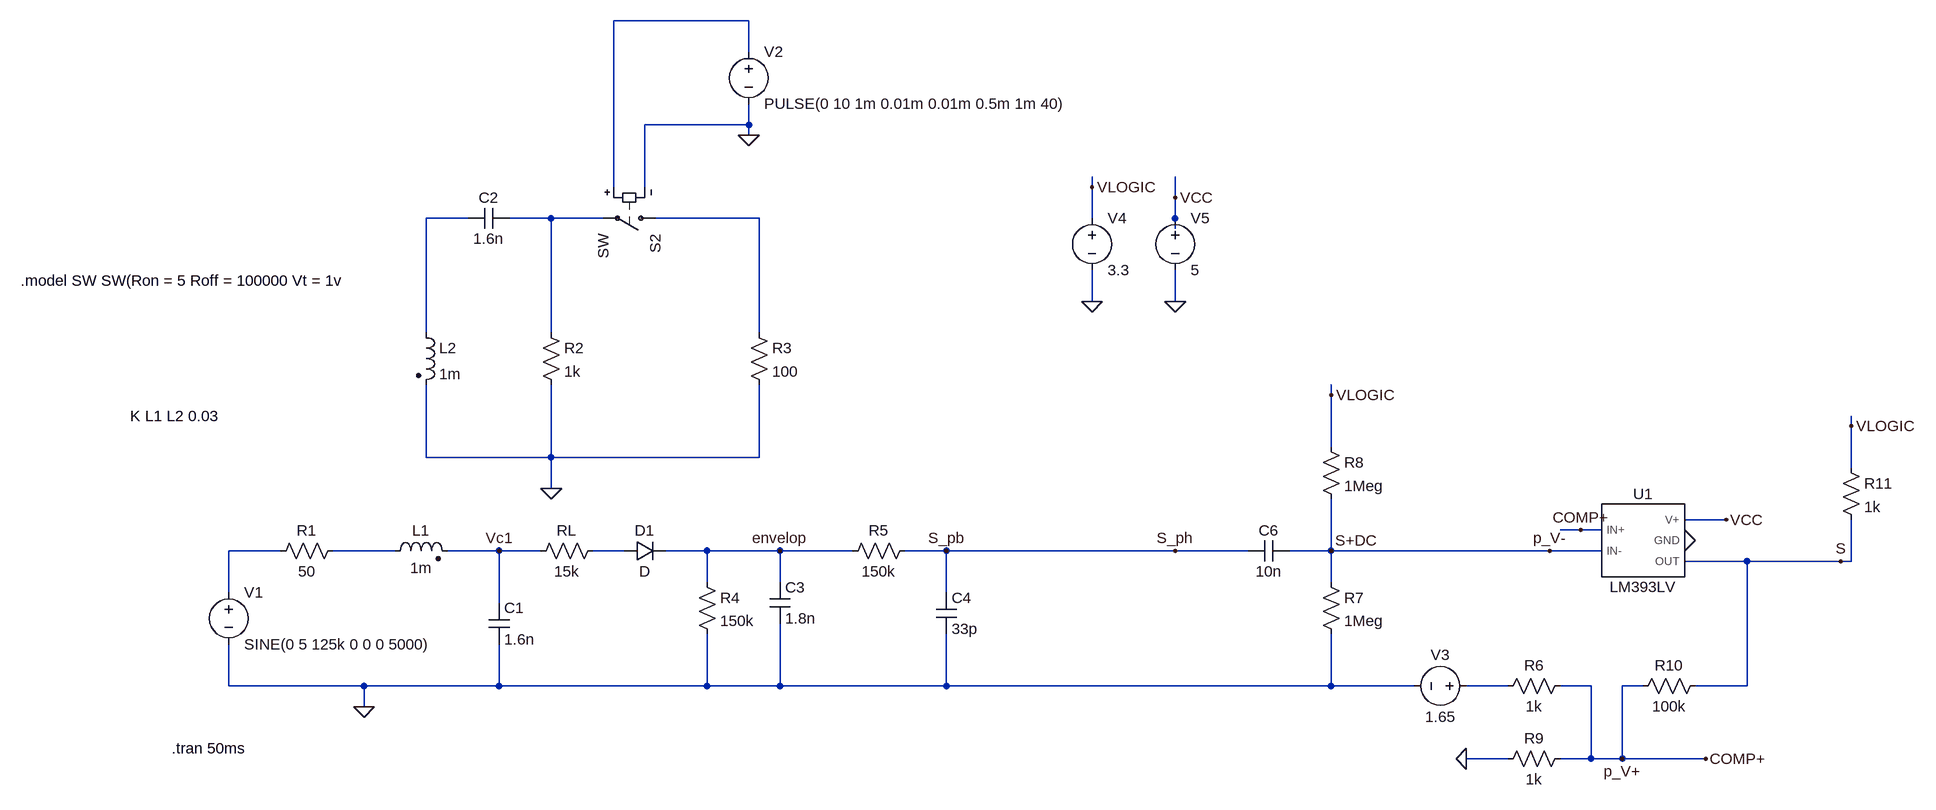
[diagram p0: schematic PJ_elec2.asc]
PJ_elec2.asc, the LTspice schematic file:
Version 4
SHEET 1 2644 680
WIRE 880 -784 672 -784
WIRE 880 -736 880 -784
WIRE 880 -624 880 -656
WIRE 880 -624 720 -624
WIRE 880 -608 880 -624
WIRE 672 -528 672 -784
WIRE 720 -528 720 -624
WIRE 1408 -528 1408 -544
WIRE 1536 -512 1536 -544
WIRE 448 -480 384 -480
WIRE 576 -480 512 -480
WIRE 656 -480 576 -480
WIRE 896 -480 736 -480
WIRE 1408 -480 1408 -528
WIRE 1536 -480 1536 -512
WIRE 1536 -464 1536 -480
WIRE 1408 -352 1408 -400
WIRE 1536 -352 1536 -400
WIRE 384 -304 384 -480
WIRE 576 -304 576 -480
WIRE 896 -304 896 -480
WIRE 1776 -208 1776 -224
WIRE 2576 -160 2576 -176
WIRE 1776 -128 1776 -208
WIRE 384 -112 384 -224
WIRE 576 -112 576 -224
WIRE 576 -112 384 -112
WIRE 896 -112 896 -224
WIRE 896 -112 576 -112
WIRE 2576 -96 2576 -160
WIRE 576 -64 576 -112
WIRE 2384 -16 2320 -16
WIRE 2160 0 2128 0
WIRE 2192 0 2160 0
WIRE 160 32 80 32
WIRE 336 32 240 32
WIRE 496 32 416 32
WIRE 560 32 496 32
WIRE 688 32 640 32
WIRE 816 32 752 32
WIRE 928 32 816 32
WIRE 1040 32 928 32
WIRE 1184 32 1120 32
WIRE 1536 32 1184 32
WIRE 1648 32 1536 32
WIRE 1776 32 1776 -48
WIRE 1776 32 1712 32
WIRE 2112 32 1776 32
WIRE 2192 32 2112 32
WIRE 2416 48 2320 48
WIRE 2560 48 2416 48
WIRE 2576 48 2576 -16
WIRE 2576 48 2560 48
WIRE 816 80 816 32
WIRE 928 80 928 32
WIRE 1776 80 1776 32
WIRE 80 96 80 32
WIRE 1184 96 1184 32
WIRE 496 112 496 32
WIRE 80 240 80 176
WIRE 288 240 80 240
WIRE 496 240 496 176
WIRE 496 240 288 240
WIRE 816 240 816 160
WIRE 816 240 496 240
WIRE 928 240 928 144
WIRE 928 240 816 240
WIRE 1184 240 1184 160
WIRE 1184 240 928 240
WIRE 1776 240 1776 160
WIRE 1776 240 1184 240
WIRE 1904 240 1776 240
WIRE 2048 240 1984 240
WIRE 2176 240 2128 240
WIRE 2256 240 2224 240
WIRE 2416 240 2416 48
WIRE 2416 240 2336 240
WIRE 288 272 288 240
WIRE 2048 352 1984 352
WIRE 2176 352 2176 240
WIRE 2176 352 2128 352
WIRE 2224 352 2224 240
WIRE 2224 352 2176 352
WIRE 2352 352 2224 352
FLAG 288 272 0
FLAG 496 32 Vc1
FLAG 880 -608 0
FLAG 576 -64 0
FLAG 928 32 envelop
FLAG 1184 32 S_pb
FLAG 1536 32 S_ph
FLAG 1776 32 S+DC
FLAG 1776 -208 VLOGIC
FLAG 1408 -352 0
FLAG 1536 -352 0
FLAG 1408 -528 VLOGIC
FLAG 1536 -512 VCC
FLAG 2320 16 0
FLAG 2384 -16 VCC
FLAG 1984 352 0
FLAG 2352 352 COMP+
FLAG 2160 0 COMP+
FLAG 2576 -160 VLOGIC
FLAG 2560 48 S
FLAG 2224 352 p_V+
FLAG 2112 32 p_V-
SYMBOL voltage 80 80 R0
WINDOW 123 0 0 Left 0
WINDOW 39 0 0 Left 0
SYMATTR InstName V1
SYMATTR Value SINE(0 5 125k 0 0 0 5000)
SYMBOL res 256 16 R90
WINDOW 0 0 56 VBottom 2
WINDOW 3 32 56 VTop 2
SYMATTR InstName R1
SYMATTR Value 50
SYMBOL ind2 320 48 R270
WINDOW 0 32 56 VTop 2
WINDOW 3 5 56 VBottom 2
SYMATTR InstName L1
SYMATTR Value 1m
SYMATTR Type ind
SYMBOL cap 480 112 R0
SYMATTR InstName C1
SYMATTR Value 1.6n
SYMBOL voltage 880 -752 R0
WINDOW 123 0 0 Left 0
WINDOW 39 0 0 Left 0
SYMATTR InstName V2
SYMATTR Value PULSE(0 10 1m 0.01m 0.01m 0.5m 1m 40)
SYMBOL sw 752 -480 R90
SYMATTR InstName S2
SYMBOL res 880 -320 R0
SYMATTR InstName R3
SYMATTR Value 100
SYMBOL res 560 -320 R0
SYMATTR InstName R2
SYMATTR Value 1k
SYMBOL ind2 368 -320 R0
SYMATTR InstName L2
SYMATTR Value 1m
SYMATTR Type ind
SYMBOL cap 512 -496 R90
WINDOW 0 0 32 VBottom 2
WINDOW 3 32 32 VTop 2
SYMATTR InstName C2
SYMATTR Value 1.6n
SYMBOL res 656 16 R90
WINDOW 0 0 56 VBottom 2
WINDOW 3 32 56 VTop 2
SYMATTR InstName RL
SYMATTR Value 15k
SYMBOL diode 688 48 R270
WINDOW 0 32 32 VTop 2
WINDOW 3 0 32 VBottom 2
SYMATTR InstName D1
SYMBOL res 1136 16 R90
WINDOW 0 0 56 VBottom 2
WINDOW 3 32 56 VTop 2
SYMATTR InstName R5
SYMATTR Value 150k
SYMBOL cap 1168 96 R0
SYMATTR InstName C4
SYMATTR Value 33p
SYMBOL cap 1712 16 R90
WINDOW 0 0 32 VBottom 2
WINDOW 3 32 32 VTop 2
SYMATTR InstName C6
SYMATTR Value 10n
SYMBOL res 1760 64 R0
SYMATTR InstName R7
SYMATTR Value 1Meg
SYMBOL res 1760 -144 R0
SYMATTR InstName R8
SYMATTR Value 1Meg
SYMBOL res 800 64 R0
SYMATTR InstName R4
SYMATTR Value 150k
SYMBOL cap 912 80 R0
SYMATTR InstName C3
SYMATTR Value 1.8n
SYMBOL voltage 1408 -496 R0
SYMATTR InstName V4
SYMATTR Value 3.3
SYMBOL voltage 1536 -496 R0
SYMATTR InstName V5
SYMATTR Value 5
SYMBOL LM393LV 2256 16 R0
SYMATTR InstName U1
SYMBOL voltage 2000 240 R90
WINDOW 0 -32 56 VBottom 2
WINDOW 3 32 56 VTop 2
SYMATTR InstName V3
SYMATTR Value 1.65
SYMBOL res 2144 224 R90
WINDOW 0 0 56 VBottom 2
WINDOW 3 32 56 VTop 2
SYMATTR InstName R6
SYMATTR Value 1k
SYMBOL res 2144 336 R90
WINDOW 0 0 56 VBottom 2
WINDOW 3 32 56 VTop 2
SYMATTR InstName R9
SYMATTR Value 1k
SYMBOL res 2352 224 R90
WINDOW 0 0 56 VBottom 2
WINDOW 3 32 56 VTop 2
SYMATTR InstName R10
SYMATTR Value 100k
SYMBOL res 2560 -112 R0
SYMATTR InstName R11
SYMATTR Value 1k
TEXT -8 336 Left 2 !.tran 50ms
TEXT -240 -384 Left 2 !.model SW SW(Ron = 5 Roff = 100000 Vt = 1v
TEXT -72 -176 Left 2 !K L1 L2 0.03

The netlist it stands for:
* PJ_elec2.asc
V1 N005 0 SINE(0 5 125k 0 0 0 5000)
R1 N006 N005 50
L1 N006 Vc1 1m
C1 Vc1 0 1.6n
V2 N001 0 PULSE(0 10 1m 0.01m 0.01m 0.5m 1m 40)
S2 N004 N003 N001 0 SW
R3 N004 0 100
R2 N003 0 1k
L2 N002 0 1m
C2 N003 N002 1.6n
RL N007 Vc1 15k
D1 N007 envelop D
R5 S_ph envelop 150k
C4 S_ph 0 33p
C6 p_V- S_ph 10n
R7 p_V- 0 1Meg
R8 VLOGIC p_V- 1Meg
R4 envelop 0 150k
C3 envelop 0 1.8n
V4 VLOGIC 0 3.3
V5 VCC 0 5
XU1 p_V+ p_V- VCC 0 S LM393LV  ; pins IN+ IN- V+ GND OUT
V3 N008 0 1.65
R6 p_V+ N008 1k
R9 p_V+ 0 1k
R10 S p_V+ 100k
R11 VLOGIC S 1k
.model D D
.lib standard.dio
.tran 50ms
.model SW SW(Ron = 5 Roff = 100000 Vt = 1v
K L1 L2 0.03
.lib C:\Users\papis\AppData\Local\LTspice\lib\lm393lv.lib
.backanno
.end